# EAGLE schematic ATMega328Programmer (EAGLE 6.1)
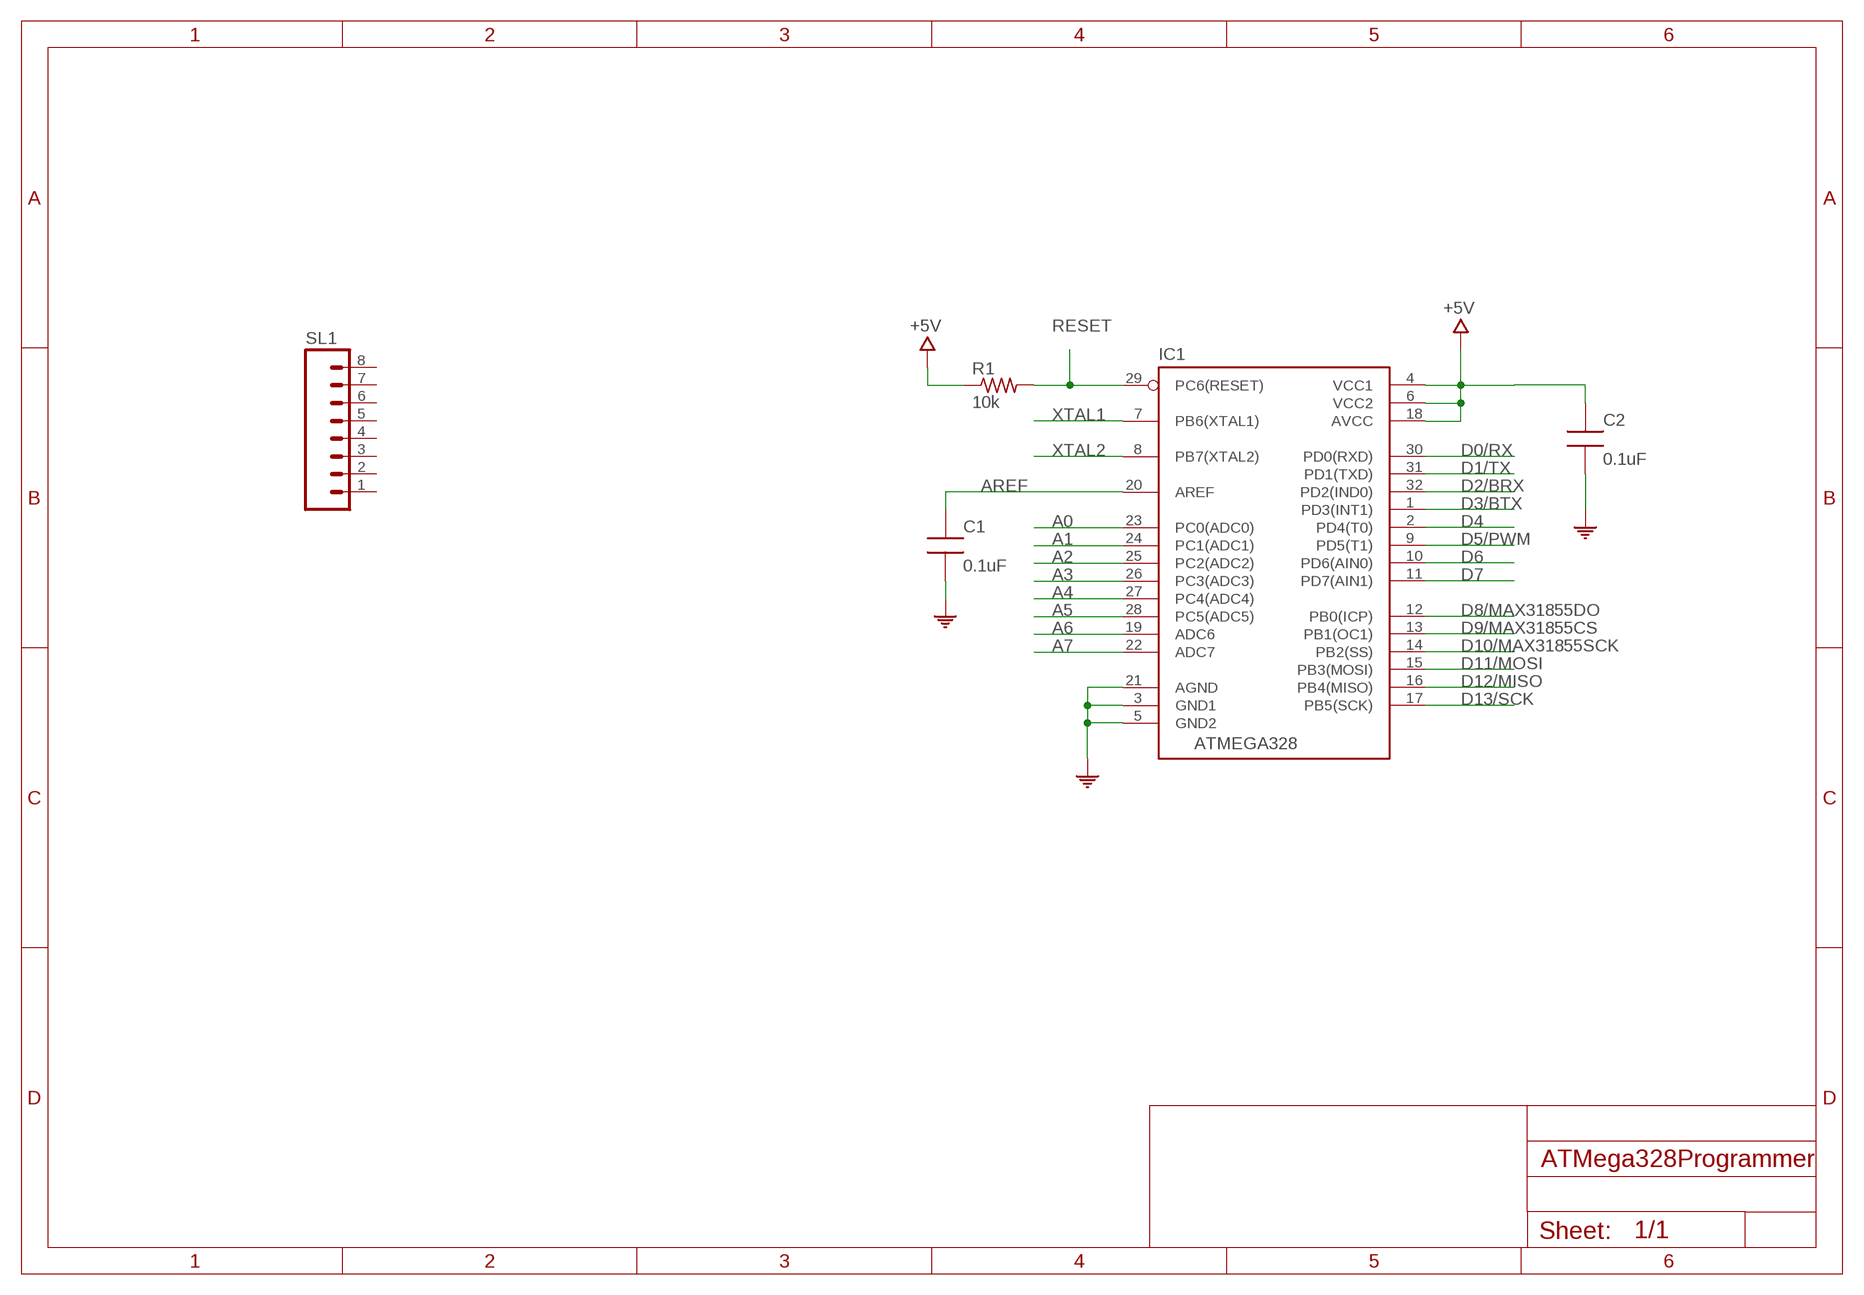
[diagram p0: schematic, sheet 1]

## Parts
C1  0.1uF  CAP0805-NP  [CAP0805-NP]
C2  0.1uF  CAP0805-NP  [CAP0805-NP]
IC1  ATMEGA328  ATMEGA168-20AU  [QFP032]
R1  10k  R-US_M0805  [M0805]
SL1  M08  [08P]

## Nets
+5V: C2.1 IC1.4(VCC1) IC1.6(VCC2) IC1.18(AVCC) R1.1
A0: IC1.23(PC0(ADC0))
A1: IC1.24(PC1(ADC1))
A2: IC1.25(PC2(ADC2))
A3: IC1.26(PC3(ADC3))
A4: IC1.27(PC4(ADC4))
A5: IC1.28(PC5(ADC5))
A6: IC1.19(ADC6)
A7: IC1.22(ADC7)
AREF: C1.1 IC1.20(AREF)
COM: C1.2 C2.2 IC1.3(GND1) IC1.5(GND2) IC1.21(AGND)
D0/RX: IC1.30(PD0(RXD))
D1/TX: IC1.31(PD1(TXD))
D2/BRX: IC1.32(PD2(IND0))
D3/BTX: IC1.1(PD3(INT1))
D4: IC1.2(PD4(T0))
D5/PWM: IC1.9(PD5(T1))
D6: IC1.10(PD6(AIN0))
D7: IC1.11(PD7(AIN1))
D8/MAX31855DO: IC1.12(PB0(ICP))
D9/MAX31855CS: IC1.13(PB1(OC1))
D10/MAX31855SCK: IC1.14(PB2(SS))
D11/MOSI: IC1.15(PB3(MOSI))
D12/MISO: IC1.16(PB4(MISO))
D13/SCK: IC1.17(PB5(SCK))
RESET: IC1.29(PC6(RESET)) R1.2
XTAL1: IC1.7(PB6(XTAL1))
XTAL2: IC1.8(PB7(XTAL2))
Unconnected: SL1.1 SL1.2 SL1.3 SL1.4 SL1.5 SL1.6 SL1.7 SL1.8

## Notes on the sheet
- RESET
- XTAL1
- XTAL2

## Library data of the parts
C1 C2 = MySMD:CAP0805-NP
IC1 = MySMD:ATMEGA168-20AU
R1 = rcl:R-US_: RESISTOR, American symbol
SL1 = con-amp-quick:M08: AMP QUICK CONNECTOR; OC_FARNELL: unknown; OC_NEWARK: unknown